# EAGLE design bp (EAGLE 6.5.0)
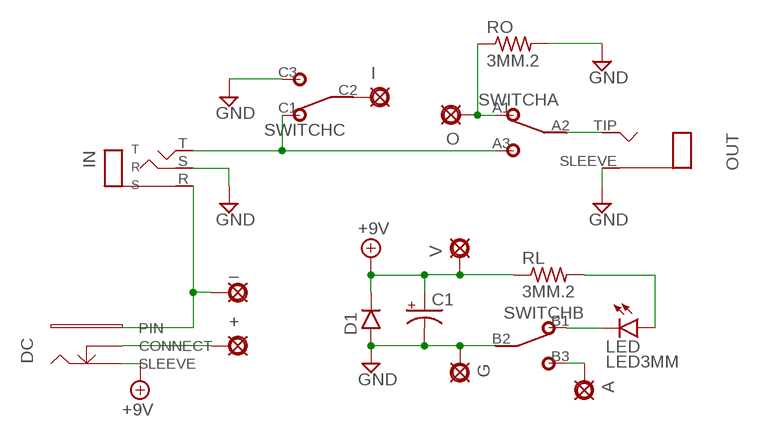
[diagram p0: schematic, sheet 1]

## Parts
+  PAD  [SQUARE]
_  PADO  [ROUND]
A  PAD8  [OCTOGON]
C1  0631  [063_025]
D1  1N400X.3  [DO41-3]
DC  DCP2  [DC_PADS2]
G  PADO  [ROUND]
I  PADO  [ROUND]
IN  STEREOP  [STEREO_PADS]
LED  LED3MM  [LED3MM]
O  PADO  [ROUND]
OUT  MONOP  [TWO_PADS]
RL  3MM.2  [R0204/2]
RO  3MM.2  [R0204/2]
SWITCH  3PDTBLUE  [CHINABLUE]
V  PADO  [ROUND]

## Nets
+9V: C1.+ D1.C DC.S(SLEEVE) RL.1 V.1(PAD)
GND: C1.- D1.A G.1(PAD) IN.S(R) OUT.SLEEVE RO.2 SWITCH.B2 SWITCH.C3
N$1: OUT.TIP SWITCH.A2
N$2: IN.T SWITCH.A3 SWITCH.C1
N$3: _.1(PAD) DC.P(PIN) IN.R(S)
N$4: LED.K(C) SWITCH.B1
N$6: +.1(PAD) DC.C(CONNECT)
N$7: LED.A RL.2
N$8: I.1(PAD) SWITCH.C2
N$9: A.1(PAD) SWITCH.B3
N$10: O.1(PAD) RO.1 SWITCH.A1

## Library data of the parts
+ _ A G I O V = gm-supply:PAD: PAD use this package for pads with any purpose, including input, output, send or return various pad shapes: round, square, octogonal, long, and long offset
C1 = gm-caps-electro-pol:063: 33 - 220uF Xicon values at Mouser.com 10V: 220uF; 16V: 100uF; 25V: 100uF; 50V: 33uF
D1 = gm-diodes:1N400X: Rectifier Diodes often used in power supply to prevent damage from reverse polarization
DC = gm-jacks:DC: DC Jack
IN = gm-jacks:STEREO: Stereo (TRS) 1/4" Phone Jack often use for the input jack to disconnect battery when there is no plug in the jack also called TRS or tip-ring-sleeve jack
LED = gm-diodes:LED
OUT = gm-jacks:MONO: Mono 1/4" Phone Jack
RL RO = gm-resistors:3MM: 3mm Resistors Leads spaced 1-6 holes apart for 0.1" perfboard. Suitable for 1/8 watt resistors.
SWITCH = gm-switches:3PDT

## Board
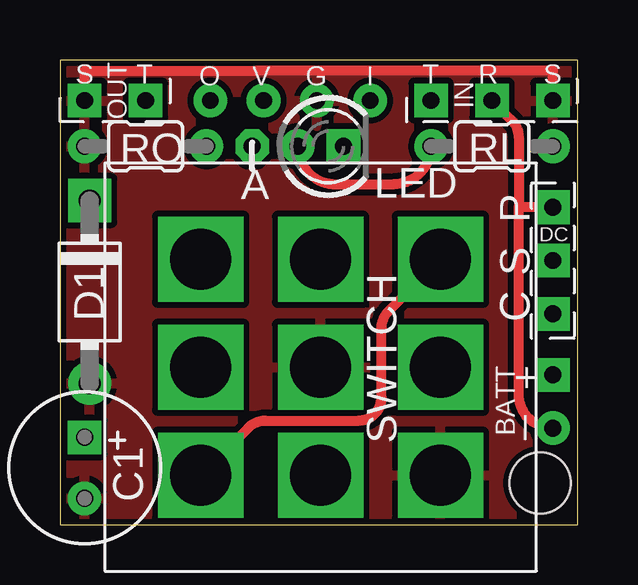
[diagram p1: board, top side]
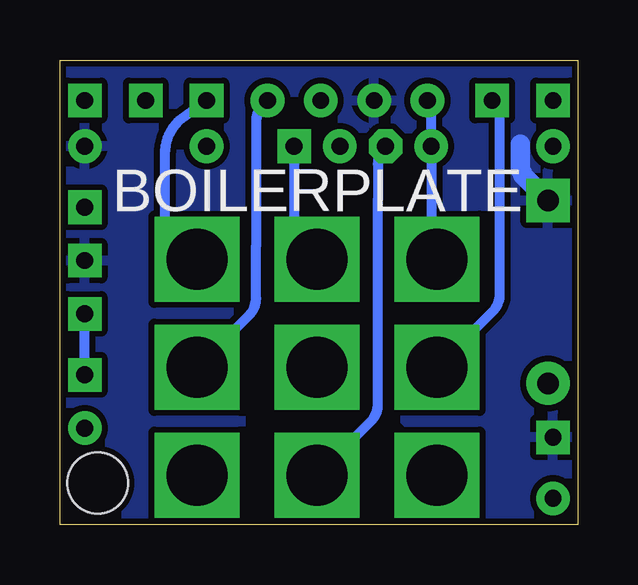
[diagram p2: board, bottom side, seen from below]

Size 21.59 x 19.35 mm. Coordinates in mm from the lower left corner, seen from the top.
Outline: 0,0 21.59,0 21.59,19.36 0,19.36 0,0
Copper layers (1*16): Top 0.035mm / dielectric 1.5mm / Bottom 0.035mm
Design rules "SparkFun *": minimum track width 8mil, minimum drill 20mil, track to track 8mil, track to pad 8mil, pad to pad 8mil, via to via 8mil, smd to smd 8mil, copper to edge 10mil, drill to drill 8mil, minimum pad ring 12mil, minimum via ring 10mil, stop-mask expansion 4mil, vias tented up to drill 25mil, thermal gap 10mil
Holes 2.54 mm at 20.02,1.73

### Footprints (pad centres in the part's own frame; a part is rotated, then mirrored left to right if it is on the bottom)
SQUARE = drill 0.7 square: 1 0,0
ROUND = drill 0.7: 1 0,0
OCTOGON = drill 0.7 octagon: 1 0,0
063_025 = drill 0.7 square: + -1.27,0 | drill 0.7: - 1.27,0
DO41-3 = drill 0.9: A 3.81,0 | drill 0.9 square: C -3.81,0
DC_PADS2 = drill 0.7 square: C -2.223,0; P 2.223,0; S 0,0
STEREO_PADS = drill 0.7 square: R 0,0; S -2.54,0; T 2.54,0
LED3MM = drill 0.7: A -1.27,0 | drill 0.7 square: K 0.635,0
TWO_PADS = drill 0.7 square: SLEEVE -1.27,0; TIP 1.27,0
R0204/2 = drill 0.7: 1 -2.54,0; 2 2.54,0
CHINABLUE = drill 2.54 square: A1 -5,4.5; A2 -5,0; A3 -5,-4.5; B1 0,4.5; B2 0,0; B3 0,-4.5; C1 5,4.5; C2 5,0; C3 5,-4.5

### Placement (x,y rotation side)
+  20.55,6.24 0 top
_  20.55,4.01 0 top
A  8.01,15.76 0 top
C1  1.03,2.36 270 top
D1  1.24,9.69 270 top
DC  20.55,11 90 top
G  10.71,17.67 270 top
I  12.93,17.67 270 top
IN  18.01,17.67 180 top
LED  11.19,15.76 0 top
O  6.27,17.67 270 top
OUT  2.3,17.67 0 top
RL  18.01,15.76 180 top
RO  3.57,15.76 180 top
SWITCH  10.87,6.55 0 top
V  8.49,17.67 270 top

### Tracks (layer width: path | path; a pad name or v marks a point on that pad's centre or on a via)
+9V
  Bottom 0.813: D1.C 2.25,14.52 arc45 2.31,14.66 arc45 2.39,14.84 2.39,15.85
  pour Bottom (isolate 0.254): -0.56,19.57 22.14,19.57 22.14,-0.11 14.05,-0.11 14.05,9.25 9.28,4.49 7.38,4.49 5.79,2.9 5.79,-0.11 -0.56,-0.11
GND
  Top 0.406: OUT.SLEEVE 1.03,18.9 6.43,18.9 8.15,18.9 20.56,18.9 IN.S
  pour Top (isolate 0.254): -0.56,19.57 22.14,19.57 22.14,-0.11 -0.56,-0.11
N$1
  Bottom 0.406: SWITCH.A2 3.54,8.88 arc-45 3.25,9.59 3.25,17.35 OUT.TIP
N$2
  Top 0.406: SWITCH.A3 7.86,4.04 arc-45 8.56,4.33 12.46,4.33 arc90 13.41,5.28 13.41,8.18 arc-45 13.7,8.89 SWITCH.C1
  Bottom 0.406: 15.95,11.13 SWITCH.C1 arc-45 16.12,11.16 17.22,11.16 17.22,15.44 arc45 16.66,16.8 IN.T
N$3
  Top 0.406: _.1 arc-90 19.13,5.44 19.13,13.22 | DC.P 19.13,13.22 | IN.R 18.83,16.85 arc-45 19.13,16.14 19.13,13.22
N$4
  Bottom 0.406: LED.K 11.82,12.01 SWITCH.B1
N$6
  Bottom 0.406: +.1 DC.C
N$7
  Top 0.406: LED.A arc90 11.51,14.17 13.89,14.17 arc90 RL.2
N$8
  Bottom 0.406: I.1 13.12,17.48 arc-45 13.41,16.78 13.41,12.9 13.41,11.63 13.41,9.43 arc45 13.7,8.72 SWITCH.C2
N$9
  Bottom 0.406: SWITCH.B3 8.62,4.3 arc-45 8.33,5.01 8.33,12.27 8.33,13.54 8.33,15.03 arc45 8.04,15.74 A.1
N$10
  Bottom 0.406: O.1 6.11,17.67 RO.1 6.11,11.29 SWITCH.A1

### Text on the board
tNames: BATT
bNames: BOILERPLATE